# Altium project Анализатор .034 -лист 3.PrjPcb
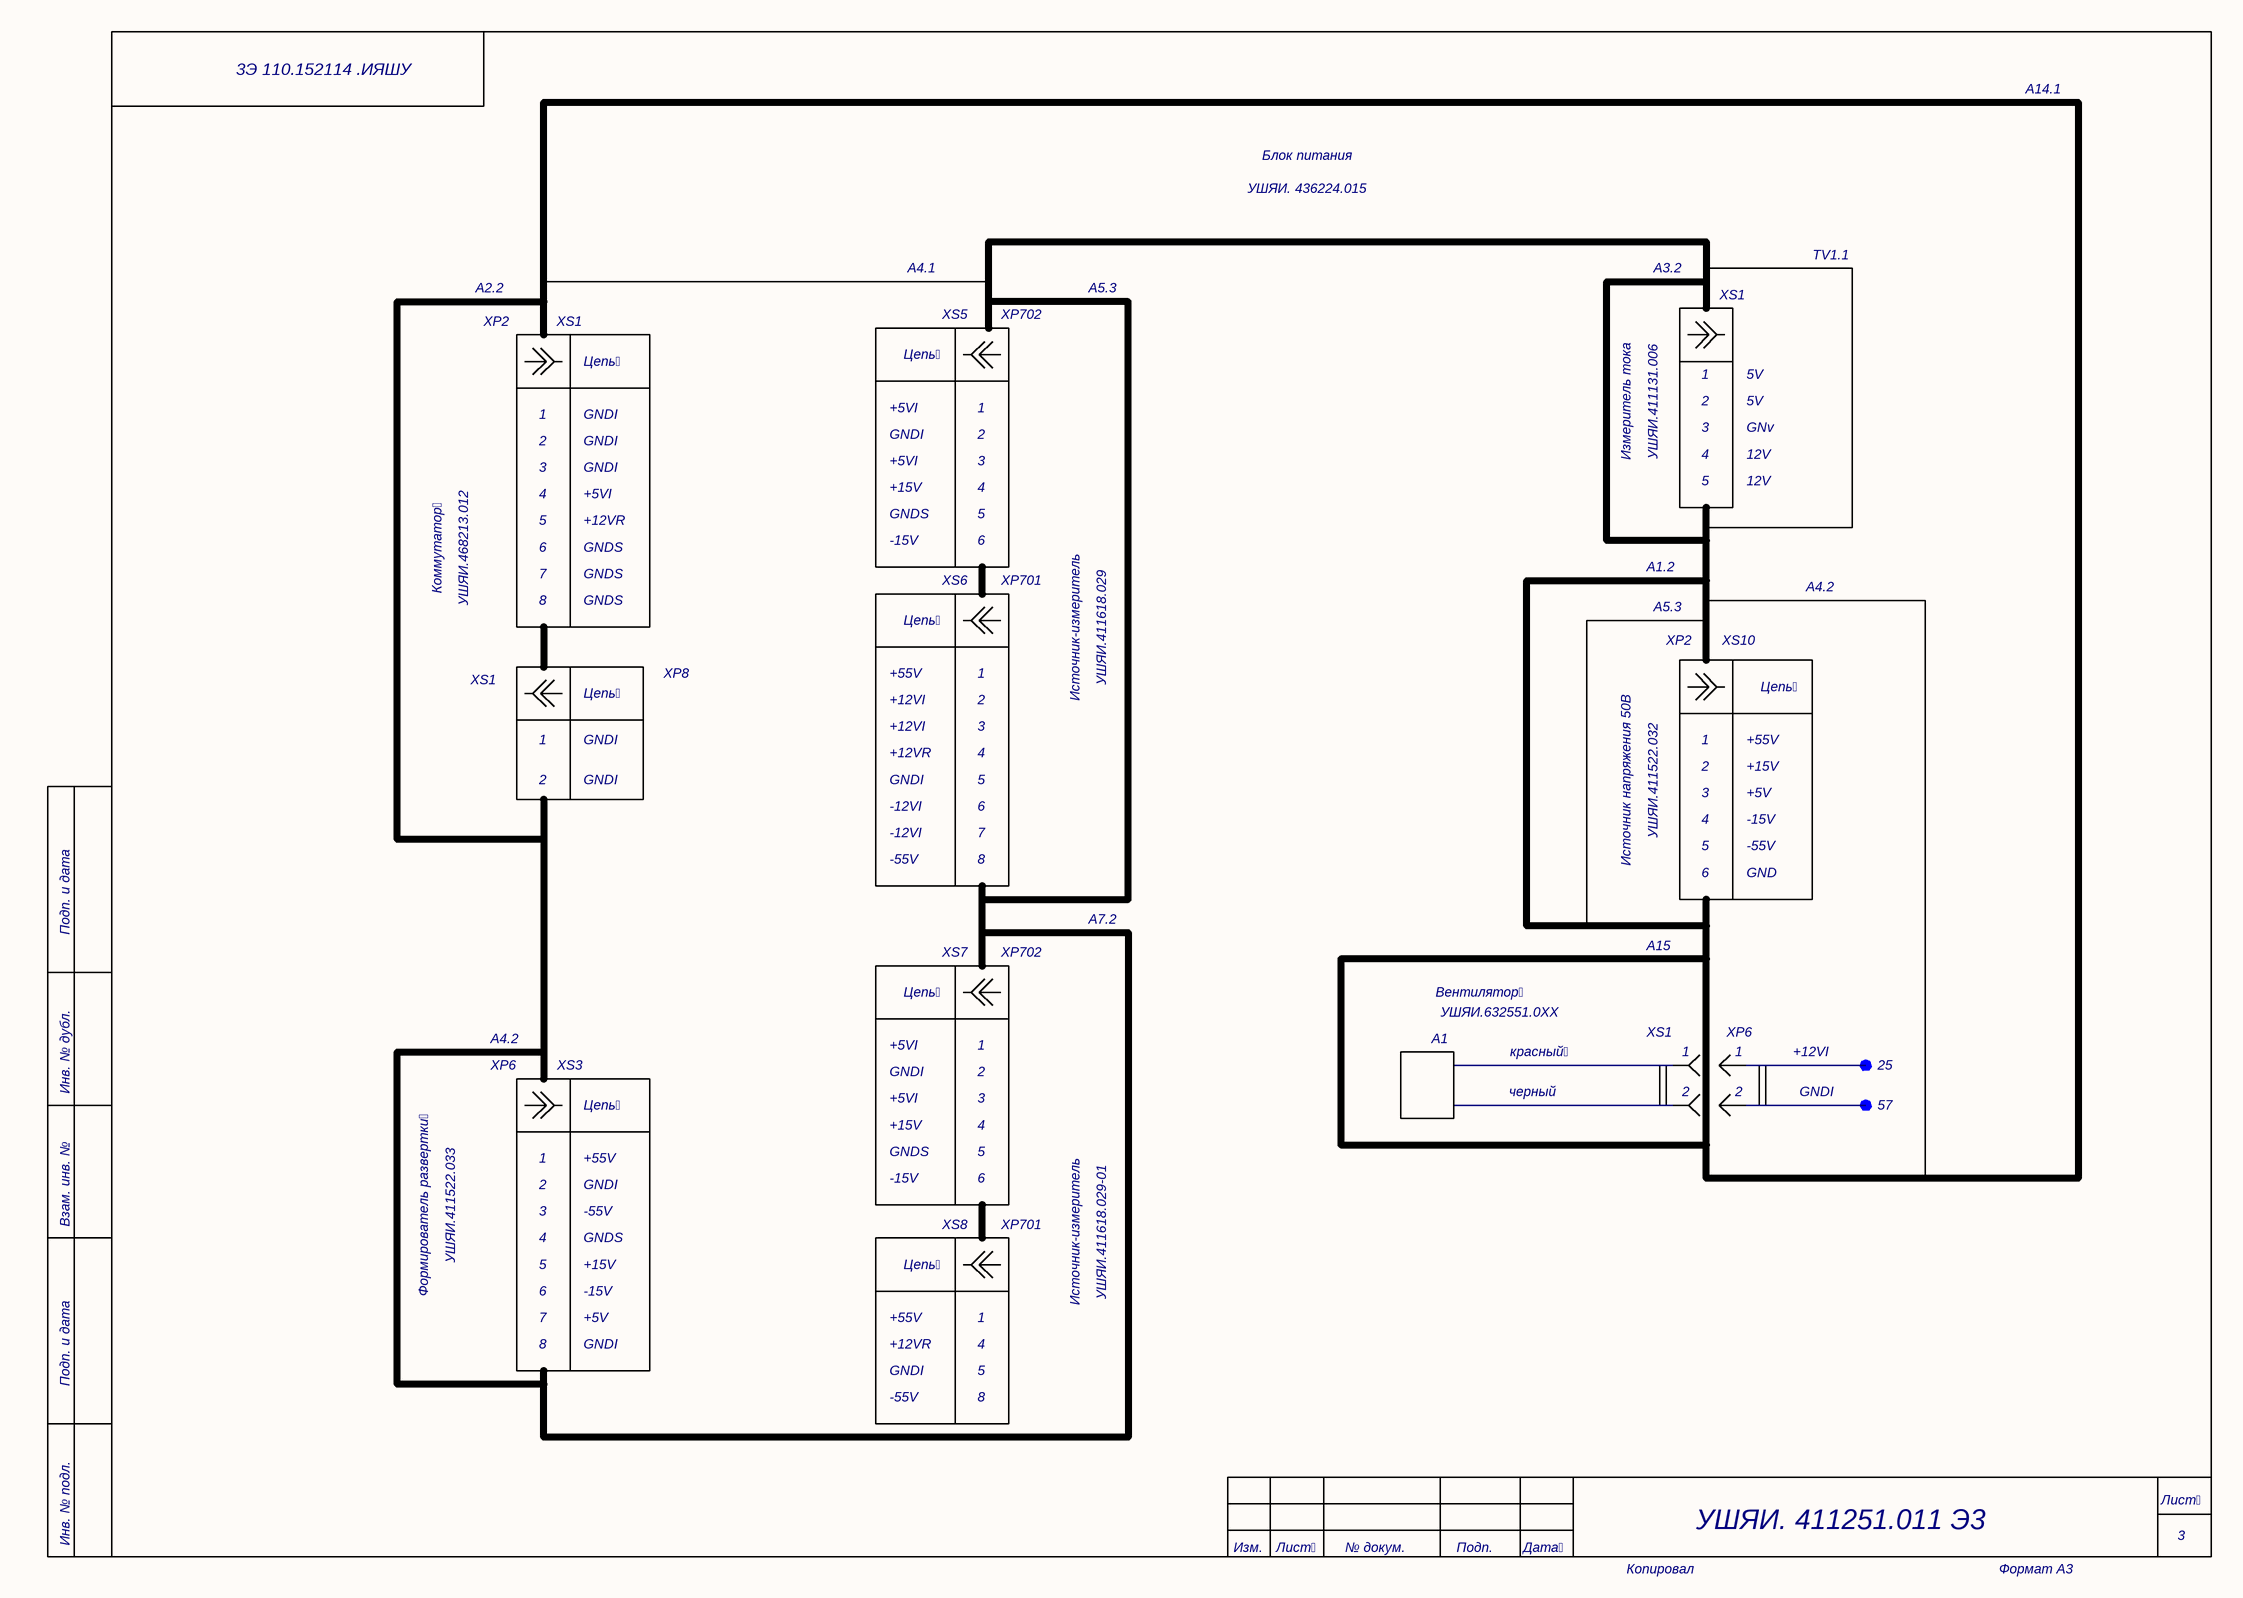
[diagram p0: Sheet1.SCHDOC]
1 sheet, 4 parts. Net scope: global (net labels, ports and power ports of the same name join across sheets).

## Sheet Sheet1.SCHDOC
size 420 x 297 mm; SheetNumber: 1; SheetTotal: 1; DocumentName: Sheet1.SCHDOC

### Parts
U226  PLUG  (value not drawn)
U227  PLUG  (value not drawn)
XS63  SOCKET  (value not drawn)
XS64  SOCKET  (value not drawn)

### Nets

Not connected (* = marked no-connect by the designer): U226 1; U227 1; XS63 1; XS64 1

### Notes on the sheet
- 3Э 110.152114 .ИЯШУ
- A14.1
- УШЯИ. 436224.015
- Блок питания
- TV1.1
- A2.2
- XP2
- XS1
- A4.1
- XS5
- XP702
- А5.3
- А3.2
- Цепь
- Измеритель тока
- УШЯИ.411131.006
- 2
- 1
- 5V
- 3
- GNDI
- +5VI
- 4
- GNv
- 12V
- 5
- +12VR
- GNDS
- +15V
- Коммутатор
- УШЯИ.468213.012
- 6
- 7
- 8
- -15V
- XS6
- XP701
- А1.2
- А4.2
- Источник-измеритель
- УШЯИ.411618.029
- XS10
- XP8
- +55V
- +12VI
- -12VI
- Источник напряжения 50В
- УШЯИ.411522.032
- +5V
- -55V
- GND
- Подп. и дата
- А7.2
- XS7
- Вентилятор
- А15
- XP6
- XS3
- А1
- УШЯИ.632551.0ХХ
- красный
- (near XS63) XS1
- (near XS63) 1
- (near U226) XP6
- (near U226) 1
- 25
- Инв. № дубл.
- черный
- (near XS64) 2
- (near U227) 2
- 57
- Формирователь развертки
- УШЯИ.411522.033
- Взам. инв. №
- XS8
- УШЯИ.411618.029-01
- Инв. № подл.
- УШЯИ. 411251.011 Э3
- Лист
- Изм.
- № докум.
- Подп.
- Дата
- Копировал
- Формат А3

### Library data of the parts
U226 U227 = PLUG: Value: 3
XS63 XS64 = SOCKET: Value: *